# EasyEDA Pro project ProPrj_测试用途_2025-09-06.epro

# Schematic Schematic1
Board Name: Board1; Create Date: 2025-08-24; Page Name: P1; Project Name: 测试用途; Schematic Name: Schematic1; Update Date: 2025-08-30; Company: 嘉立创EDA; Page Size: A4; Version: V1.0
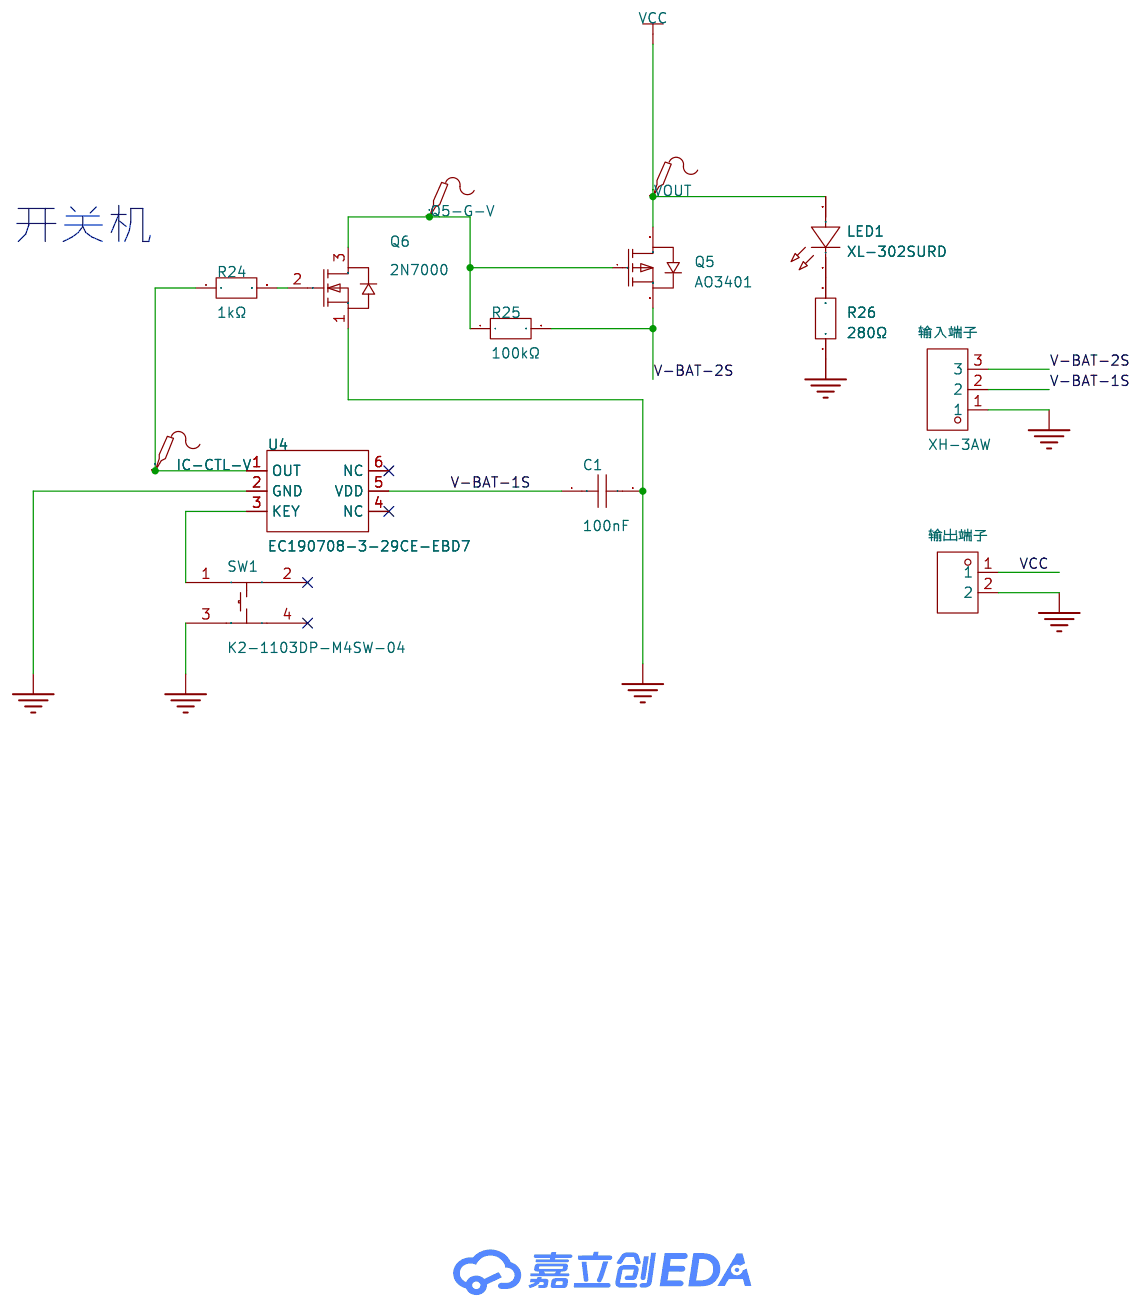
[diagram p0: schematic sheet]

## Parts
C1  100nF  [CAP-TH_L5.0-W2.5-P5.00-D1.0]
IC-CTL-V  -  [Test-Point-0.5mm]
LED1  XL-302SURD  [LED-TH_BD3.8-P2.54-RD]
Q5  AO3401  [SOT-23-3_L2.9-W1.4-P1.90-LS2.6-BR]
Q5-G-V  -  [Test-Point-0.5mm]
Q6  2N7000  [TO-92-3_L4.9-W3.7-P1.27-L]
R24  1kΩ  [RES-TH_BD2.4-L6.3-P10.30-D0.6]
R25  100kΩ  [RES-TH_BD2.4-L6.3-P10.30-D0.6]
R26  280Ω  [RES-TH_BD2.4-L6.3-P10.30-D0.6]
SW1  K2-1103DP-M4SW-04  [SW-TH_4P-L12.0-W12.0-P5.00-LS12.5_TC-1103XX]
U4  EC190708-3-29CE-EBD7  [SOT-23-6_L2.9-W1.6-P0.95-LS2.9-BL]
VOUT  -  [Test-Point-0.5mm]
输入端子  XH-3AW  [CONN-TH_3P-P2.54_HCTL_XH-3AW]
输出端子  KF301-5.0-2P  [CONN-TH_P5.00_KF301-5.0-2P]

## Library data of the parts
C1 = CC1H104MC1FD3F6C10MF: 容值:100nF;精度:±20%;额定电压:50V;温度系数:Y5V;; LCSC Part Name: 100nF ±20% 50V; Supplier Part: C254085; Manufacturer: Dersonic(德尔创); Supplier Footprint: 插件,P=5.08mm; JLCPCB Part Class: 扩展库; Datasheet: https://atta.szlcsc.com/upload/public/pdf/source/20200826/C254085_159DD65BF32BF11C9168D341BCE23E6F.pdf; Supplier: LCSC; Tolerance: ±20%; Voltage Rating: 50V; Pin Spacing: 5.08mm; Temperature Coefficient: Y5V; Diameter: 6mm; Body Thickness: 2.2mm
IC-CTL-V Q5-G-V VOUT = Test-Point: Test Point 测试点
LED1 = XL-302SURD: 灯头类型:3mm圆形灯头;发光颜色:红色;功率:80mW;正向电流:30mA;主波长:615nm~620nm;透镜颜色:红色透镜;色温:-;发光角度:50°;载带方式:-;工作温度:-25℃~+85℃;; Supplier Part: C2895470; Manufacturer: XINGLIGHT(成兴光); Supplier Footprint: 插件,D=3mm; JLCPCB Part Class: 扩展库; Datasheet: https://atta.szlcsc.com/upload/public/pdf/source/20240112/E1E2B82945FD635E4907401DDE6D4922.pdf; Supplier: LCSC; Lamp Holder Type: 3mm圆形灯头; Emitted Color: 红色; Power Dissipation: 80mW; Forward Current: 30mA; Dominant Wavelength: 615nm~620nm; Peak Wavelength: 625nm; Lens Color: 红色透镜; Viewing Angle: 50°; Operating Temperature: -25℃~+85℃
Q5 = AO3401_C727156: 类型:1个P沟道;漏源电压(Vdss):30V;连续漏极电流(Id):4.2A;导通电阻(RDS(on)@Vgs,Id):65mΩ@10V,4.2A;功率:350mW;阈值电压(Vgs(th)@Id):1.3V@250uA;; LCSC Part Name: 1个P沟道 耐压:30V 电流:4.2A; Supplier Part: C727156; Manufacturer: TWGMC(台湾迪嘉); Supplier Footprint: SOT-23; JLCPCB Part Class: 扩展库; Datasheet: https://atta.szlcsc.com/upload/public/pdf/source/20200827/C727156_6E081BBEEFBC6B8FEE164CB196B0AF30.pdf; Supplier: LCSC; Type: 1个P沟道; Drain Source Voltage (Vdss): 30V; Continuous Drain Current (Id): 4.2A; Drain Source On Resistance (RDS(on)@Vgs,Id): 65mΩ@10V,4.2A; Power Dissipation (Pd): 350mW; Gate Threshold Voltage (Vgs(th)@Id): 1.3V@250uA; Input Capacitance (Ciss@Vds): 954pF; Reverse Transfer Capacitance (Crss@Vds): 77pF; Operating Temperature: -55℃~+150℃
Q6 = 2N7000: 类型:1个N沟道;漏源电压(Vdss):60V;连续漏极电流(Id):200mA;导通电阻(RDS(on)@Vgs,Id):5Ω@10V,500mA;功率(Pd):400mW;阈值电压(Vgs(th)@Id):3V@1mA;; LCSC Part Name: 1个N沟道 耐压:60V 电流:200mA; Supplier Part: C232838; Manufacturer: onsemi(安森美); Supplier Footprint: TO-92-3; JLCPCB Part Class: 扩展库; Datasheet: https://atta.szlcsc.com/upload/public/pdf/source/20221020/6B07E43F0B4B9B39AB447A9A1885F5BD.pdf; Supplier: LCSC; Type: 1个N沟道; Drain Source Voltage (Vdss): 60V; Continuous Drain Current (Id): 200mA; Drain Source On Resistance (RDS(on)@Vgs,Id): 5Ω@10V,500mA; Power Dissipation (Pd): 400mW; Gate Threshold Voltage (Vgs(th)@Id): 3V@1mA
R24-R26 = RN1/4W10KFT/BA1: 电阻类型:金属膜电阻;阻值:10kΩ;精度:±1%;功率:250mW;温度系数:±50ppm/℃;; LCSC Part Name: 10kΩ ±1% 250mW 金属膜电阻; Supplier Part: C410695; Manufacturer: Tyohm(幸亚电阻); Supplier Footprint: 插件,D2.4xL6.5mm; JLCPCB Part Class: 扩展库; Datasheet: https://atta.szlcsc.com/upload/public/pdf/source/20250211/2C0505E212032D72CE625B2E6B5197BA.pdf; Supplier: LCSC; Type: 金属膜电阻; Tolerance: ±1%; Voltage-Supply(Max): 250V; Power(Watts): 250mW; Temperature Coefficient: ±50ppm/℃; Operating Temperature: -55℃~+125℃
SW1 = K2-1103DP-M4SW-04_C136702: Supplier Part: C136702; Supplier Footprint: 12x12mm; JLCPCB Part Class: 扩展库; Supplier: LCSC
U4 = EC190708-3-29CE-EBD7: Supplier Part: C9900183753; Supplier Footprint: SOT23-6; Supplier: LCSC
输入端子 = XH-3AW_C2908612: 插针结构:1x3P;间距:2.54mm;安装方式:弯插;参考系列:XH;总PIN数:3P;排数:1;每排PIN数:3;行距:-;额定电流:3A;触头材质:黄铜;触头镀层:锡;工作温度范围:-25℃~+85℃;; LCSC Part Name: 1x3P 间距:2.54mm 弯插 系列:XH; Supplier Part: C2908612; Manufacturer: HCTL(华灿天禄); Supplier Footprint: 弯插,P=2.5mm; JLCPCB Part Class: 扩展库; Datasheet: https://atta.szlcsc.com/upload/public/pdf/source/20230711/B565BAF3B11666EF6B81B3605408F2BD.pdf; Supplier: LCSC; Pins Structure: 1x3P; Pitch: 2.54mm; Mounting Style: 弯插; Reference Series: XH; Number of Pins: 3P; Number of Rows: 1; Number of PINs Per Row: 3; Current Rating (Max): 3A; Contact Material: 黄铜; Contact Plating: 锡; Operating Temperature Range: -25℃~+85℃
输出端子 = KF301-5.0-2P: 结构:1x2P;间距:5mm;颜色:蓝色;安装方式:直插;额定电流:17A;额定电压:250V;排数:1;线规 - AWG:14~22;线规 - 平方毫米:1.5;每排PIN数:2;工作温度范围:-30℃~+120℃;; LCSC Part Name: 5mm 1x2P 排数:1 每排P数:2 直插; Supplier Part: C474881; Manufacturer: KEFA(科发); Supplier Footprint: 插件,P=5mm; JLCPCB Part Class: 扩展库; Datasheet: https://atta.szlcsc.com/upload/public/pdf/source/20230317/03A5B5FC229D6F9225E8F51DA1A4E80A.pdf; Supplier: LCSC; Structure: 1x2P; Pitch: 5mm; Color: 蓝色; Mounting Style: 直插; Current Rating (Max): 17A; Voltage Rating (Max): 250V; Number of Pins: 2P; Number of Rows: 1; Wire Gauge - AWG: 14~22; Wire Gauge - mm2: 1.5; Number of PINs Per Row: 2; Operating Temperature Range: -30℃~+120℃

## Nets
GND: C1.2 Q6.1(S) R26.1 SW1.3 U4.2(GND) 输入端子.1 输出端子.2
VCC: LED1.2(A) Q5.3(D) VOUT.1 输出端子.1
V-BAT-1S: C1.1 U4.5(VDD) 输入端子.2
V-BAT-2S: Q5.2(S) R25.2 输入端子.3
$1N406: IC-CTL-V.1 R24.1 U4.1(OUT)
$1N407: SW1.1 U4.3(KEY)
$1N410: Q5.1(G) Q5-G-V.1 Q6.3(D) R25.1
$1N412: Q6.2(G) R24.2
$1N1137: LED1.1(K) R26.2

Not connected (* = marked no-connect by the designer): SW1 2* 4*; U4 4(NC)* 6(NC)*

## Notes on the sheet
- 开关机

# Schematic Schematic2
Board Name: Board2; Create Date: 2025-08-31; Page Name: P1; Project Name: 测试用途; Schematic Name: Schematic2; Update Date: 2025-09-03; Company: 嘉立创EDA; Page Size: A4; Version: V1.0
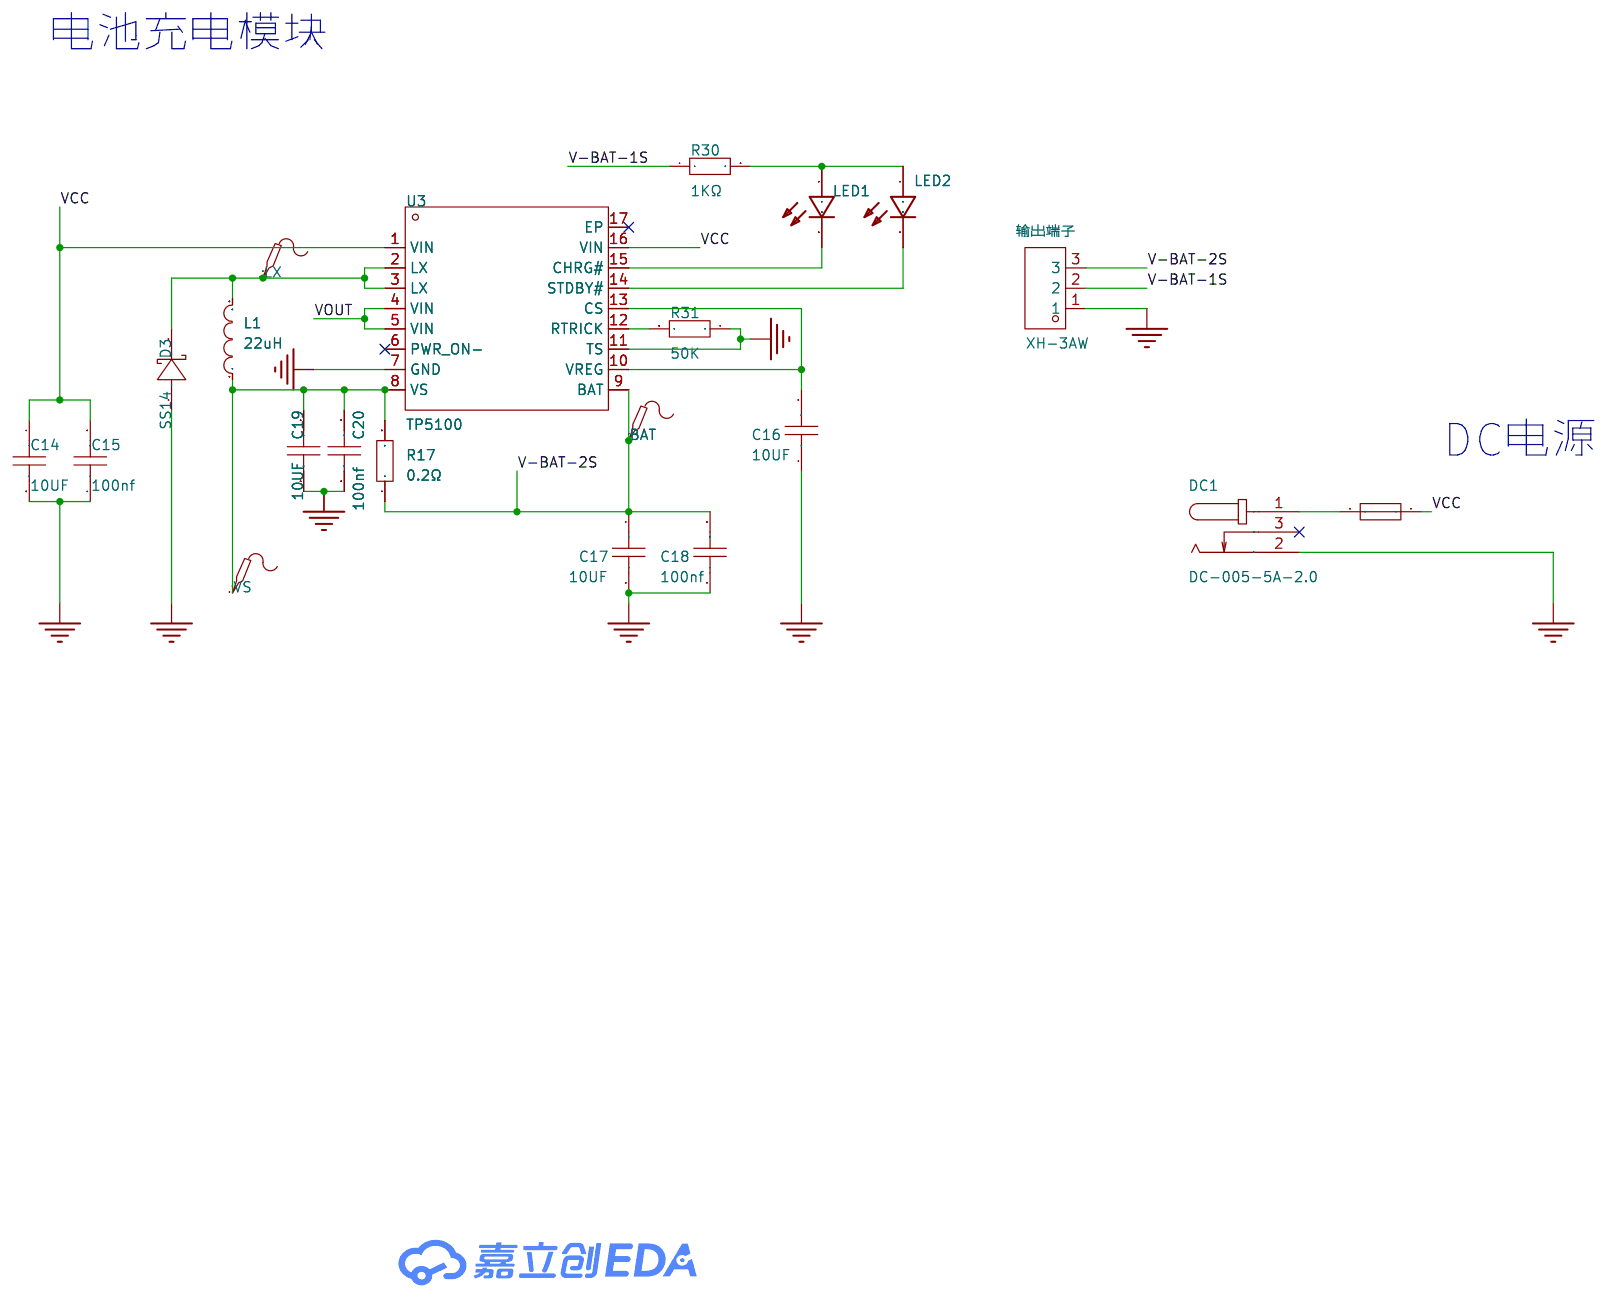
[diagram p1: schematic sheet]

## Parts
BAT  -  [Test-Point-0.5mm]
C14  10UF  [C1210]
C15  100nf  [C1206]
C16  10UF  [C1206]
C17  10UF  [C1210]
C18  100nf  [C1206]
C19  10UF  [C1210]
C20  100nf  [C1206]
D3  SS14  [SMA_L4.3-W2.6-LS5.0-FD]
DC1  DC-005-5A-2.0  [DC-IN-TH_DC-005-5A-2.0]
F1  SMD1206  [F1206]
L1  22uH  [IND-SMD_L12.0-W12.0_YPRH120X]
LED1  19-217/BHC-ZL1M2RY/3T  [LED0603-R-RD]
LED2  19-217/BHC-ZL1M2RY/3T  [LED0603-R-RD]
LX  -  [Test-Point-0.5mm]
R17  0.2Ω  [R1206]
R30  1KΩ  [R1206]
R31  50K  [R1206]
U3  TP5100  [TQFN-16_L4.0-W4.0-P0.65-BL-EP]
VS  -  [Test-Point-0.5mm]
输出端子  XH-3AW  [CONN-TH_3P-P2.54_HCTL_XH-3AW]

## Library data of the parts
BAT LX VS = Test-Point: Test Point 测试点
C14 C17 C19 = HGC1210R5476M250NSVK: 容值:47uF;精度:±20%;额定电压:25V;温度系数:X5R;; LCSC Part Name: 47uF ±20% 25V; Supplier Part: C7432791; Manufacturer: Chinocera(华瓷); Supplier Footprint: 1210; JLCPCB Part Class: 扩展库; Datasheet: https://atta.szlcsc.com/upload/public/pdf/source/20240320/FAC3FEC40A78BC5CCCE96C232A94D860.pdf; Supplier: LCSC; Tolerance: ±20%; Voltage Rating: 25V; Temperature Coefficient: X5R
C15 C16 C18 C20 = HGC1206R5106K500NSPJ: 容值:10uF;精度:±10%;额定电压:50V;温度系数:X5R;; LCSC Part Name: 10uF ±10% 50V; Supplier Part: C7432781; Manufacturer: Chinocera(华瓷); Supplier Footprint: 1206; JLCPCB Part Class: 扩展库; Datasheet: https://atta.szlcsc.com/upload/public/pdf/source/20240320/FAC3FEC40A78BC5CCCE96C232A94D860.pdf; Supplier: LCSC; Tolerance: ±10%; Voltage Rating: 50V; Temperature Coefficient: X5R
D3 = SS14_C7420316: 二极管配置:独立式;正向压降(Vf):550mV@1.0A;直流反向耐压(Vr):40V;整流电流:1A;; LCSC Part Name: 电压:40V 电流:1A; Supplier Part: C7420316; Manufacturer: 宏迦橙; Supplier Footprint: SMA(DO-214AC); JLCPCB Part Class: 扩展库; Datasheet: https://atta.szlcsc.com/upload/public/pdf/source/20230828/C73881E3299A0827586C2B1C18B17A53.pdf; Supplier: LCSC; Diode Configuration: 独立式; Forward Voltage (Vf@If): 550mV@1.0A; Reverse Voltage (Vr): 40V; Rectified Current: 1A; Reverse Leakage Current (Ir): 200uA@40V
DC1 = DC-005-5A-2.0: 连接器类型:DC电源插座;安装方式:弯插;触点内径:2mm;触点外径:6.2mm;额定电流:5A;额定电压:24V;工作温度范围:-20℃~+70℃;; LCSC Part Name: DC电源插座 内径:2mm 外径:6.2mm; Supplier Part: C381116; Manufacturer: XKB Connection(中国星坤); Supplier Footprint: 插件; JLCPCB Part Class: 扩展库; Datasheet: https://atta.szlcsc.com/upload/public/pdf/source/20211015/707A35F7AB6E89C57AAB641950105BB7.pdf; Supplier: LCSC; Connector Type: DC电源插座; Mounting Style: 弯插; Inside Contact Diameter: 2mm; Outside Contact Diameter: 6.2mm; Current Rating (Max): 5A; Voltage Rating (Max): 24V; Operating Temperature Range: -20℃~+70℃
F1 = SMD1206-150-16: 耐压(Vmax):16V;最大电流(Imax):40A;保持电流(Ihold):1.5A;跳闸电流(Itrip):3A;; Supplier Part: C46641031; Manufacturer: 宏嘉诚; Supplier Footprint: 1206; JLCPCB Part Class: 扩展库; Datasheet: https://atta.szlcsc.com/upload/public/pdf/source/20250414/5AC46D2F961B725C9DB708C91B04DBEC.pdf; Supplier: LCSC; Voltage - Max: 16V; Current - Max: 40A; Hold Current: 1.5A; Trip Current: 3A; Power Dissipation: 1W; Resistance - Initial (Ri) (Min): 25mΩ; Resistance - Post Trip (R1) (Max): 130mΩ; Time to Trip(Max): 300ms
L1 = YPRH1207-220M: 电感值:22uH;精度:±20%;额定电流:3.6A;; LCSC Part Name: 22uH ±20%; Supplier Part: C339950; Manufacturer: YJYCOIN(益嘉源); Supplier Footprint: SMD,12x12mm; JLCPCB Part Class: 扩展库; Datasheet: https://atta.szlcsc.com/upload/public/pdf/source/20200623/C339950_CB2CAFE108BC5DE837AA8F39C29DA454.pdf; Supplier: LCSC; Tolerance: ±20%; Rated Current: 3.6A; DC Resistance (DCR): 43mΩ
LED1 LED2 = 19-217/BHC-ZL1M2RY/3T: Supplier: LCSC; Manufacturer: EVERLIGHT; image: //image.lceda.cn/szlcsc/C72041.jpg; Supplier Part: C72041; JLCPCB Part Class: Basic; spicePre: L
R17 R30 R31 = 1206W4F1002T5E: 电阻类型:厚膜电阻;阻值:10kΩ;精度:±1%;功率:250mW;最大工作电压:200V;温度系数:±100ppm/℃;; LCSC Part Name: 10kΩ ±1% 250mW 厚膜电阻; Supplier Part: C17902; Manufacturer: UNI-ROYAL(厚声); Supplier Footprint: 1206; JLCPCB Part Class: 基础库; Datasheet: https://atta.szlcsc.com/upload/public/pdf/source/20200306/C422600_1E6D84923E4A46A82E41ADD87F860B5C.pdf; Supplier: LCSC; Type: 厚膜电阻; Tolerance: ±1%; Power(Watts): 250mW; Overload Voltage (Max): 200V; Temperature Coefficient: ±100ppm/℃; Operating Temperature Range: -55℃~+155℃
U3 = TP5100: Supplier Part: C379389; Manufacturer: TOPPOWER(南京拓微); Supplier Footprint: TQFN-16-EP(4x4); JLCPCB Part Class: 扩展库; Datasheet: https://atta.szlcsc.com/upload/public/pdf/source/20230625/310531CA6E48A76C009AF7A61C581768.pdf; Supplier: LCSC
输出端子 = XH-3AW_C2908612: 插针结构:1x3P;间距:2.54mm;安装方式:弯插;参考系列:XH;总PIN数:3P;排数:1;每排PIN数:3;行距:-;额定电流:3A;触头材质:黄铜;触头镀层:锡;工作温度范围:-25℃~+85℃;; LCSC Part Name: 1x3P 间距:2.54mm 弯插 系列:XH; Supplier Part: C2908612; Manufacturer: HCTL(华灿天禄); Supplier Footprint: 弯插,P=2.5mm; JLCPCB Part Class: 扩展库; Datasheet: https://atta.szlcsc.com/upload/public/pdf/source/20230711/B565BAF3B11666EF6B81B3605408F2BD.pdf; Supplier: LCSC; Pins Structure: 1x3P; Pitch: 2.54mm; Mounting Style: 弯插; Reference Series: XH; Number of Pins: 3P; Number of Rows: 1; Number of PINs Per Row: 3; Current Rating (Max): 3A; Contact Material: 黄铜; Contact Plating: 锡; Operating Temperature Range: -25℃~+85℃

## Nets
GND: C14.2 C15.1 C16.1 C17.2 C18.1 C19.2 C20.1 D3.1(A) DC1.2 R31.1 U3.7(GND) U3.11(TS) 输出端子.1
VCC: C14.1 C15.2 F1.1 U3.1(VIN) U3.16(VIN)
V-BAT-1S: R30.1 输出端子.2
V-BAT-2S: BAT.1 C17.1 C18.2 R17.1 U3.9(BAT) 输出端子.3
VOUT: U3.4(VIN) U3.5(VIN)
$1N694: D3.2(K) L1.2 LX.1 U3.2(LX) U3.3(LX)
$1N699: C16.2 U3.10(VREG) U3.13(CS)
$1N702: C19.1 C20.2 L1.1 R17.2 U3.8(VS) VS.1
$1N712: R31.2 U3.12(RTRICK)
Net-(DC1-1): DC1.1 F1.2
Net-(LED1-1): LED1.1(A) LED2.1(A) R30.2
Net-(LED1-2): LED1.2(C) U3.15(CHRG#)
Net-(LED2-2): LED2.2(C) U3.14(STDBY#)

Not connected (* = marked no-connect by the designer): DC1 3*; U3 6(PWR_ON-)* 17(EP)*

## Notes on the sheet
- 电池充电模块
- DC电源

# Board PCB1
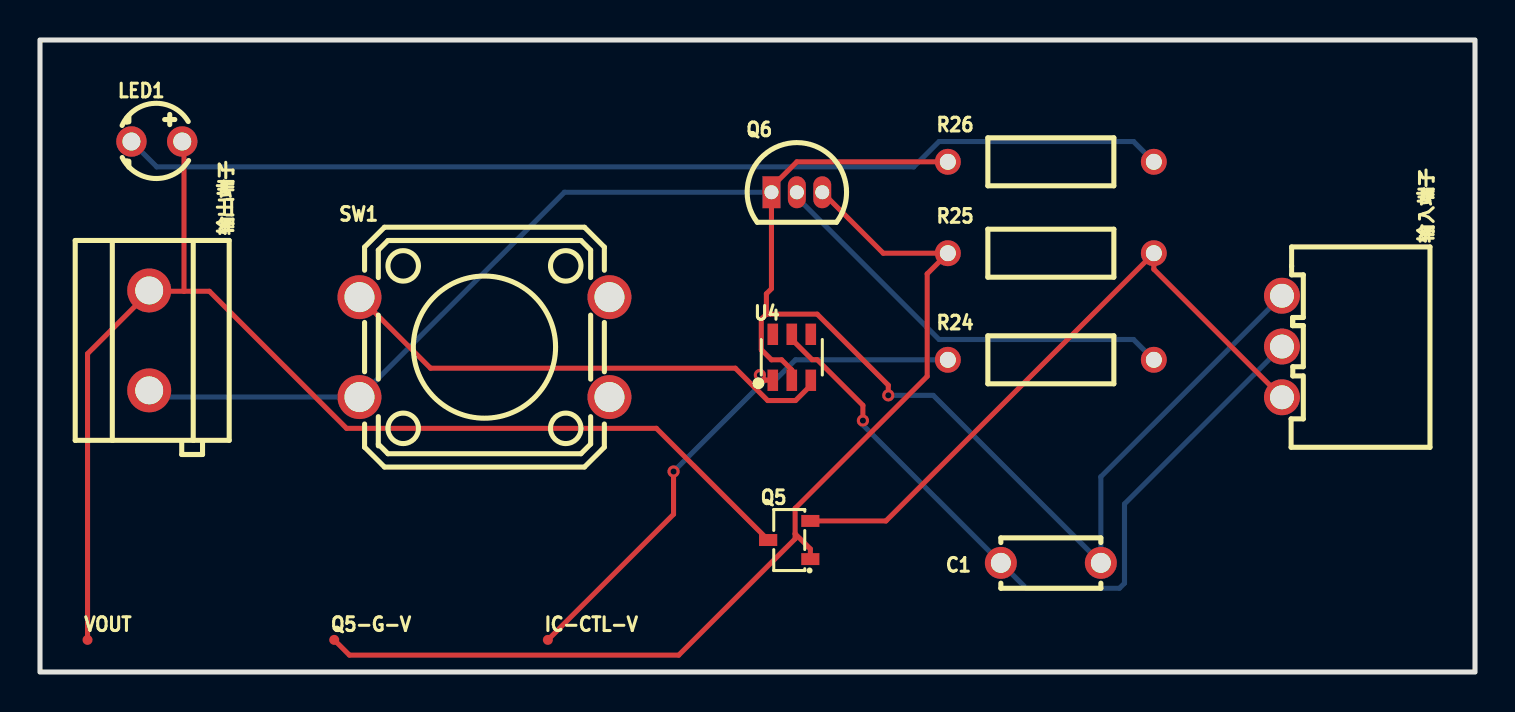
[diagram p2: board, top side]
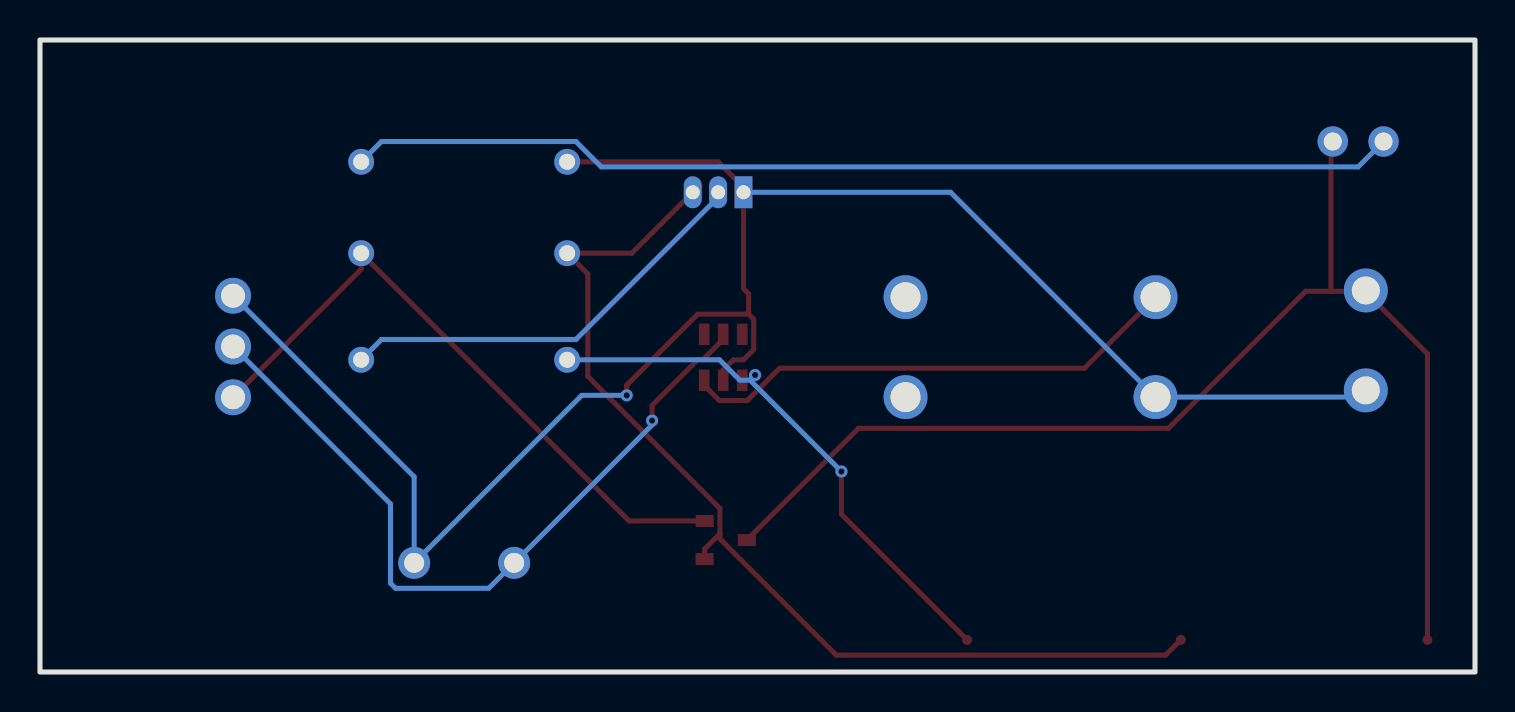
[diagram p3: board, bottom side, seen from below]

Outline 71.75 x 31.62 mm; copper layers: Top Layer, Bottom Layer. Coordinates in mm from the lower left corner of the outline.
Outline path: rectangle 0,31.62 71.75,0
Stack: Top Layer 0.035mm / Dielectric1 1.51mm FR4 er 4.5 / Bottom Layer 0.035mm

## Design rules (mm)
template: JLCPCB Capability(Two Layers Board)
spacing copperThickness1oz (default): track to track 0.102, other pairs 0.152 to 0.3
spacing copperThickness2oz: track to track 0.203, other pairs 0.152 to 0.3
track width copperThickness1oz (default): min 0.127, default 0.254, max 2.54
track width copperThickness2oz: min 0.203, default 0.254, max 2.54
differential pair differentialPair (default): width min 0.127, default 0.254, max 2.54; gap min 0.152, default 0.152
via viaSize (default): diameter min 0.5, default 0.61, max 10; hole min 0.3, default 0.305, max 6.3

## Placement (name value [footprint] x y rotation side)
C1  100nF  [CAP-TH_L5.0-W2.5-P5.00-D1.0]  50.55 5.46 0 top
IC-CTL-V  -  [Test-Point-0.5mm]  25.4 1.61 0 top
LED1  XL-302SURD  [LED-TH_BD3.8-P2.54-RD]  5.84 26.54 0 top
Q5  AO3401  [SOT-23-3_L2.9-W1.4-P1.90-LS2.6-BR]  37.46 6.6 0 top
Q5-G-V  -  [Test-Point-0.5mm]  14.71 1.61 0 top
Q6  2N7000  [TO-92-3_L4.9-W3.7-P1.27-L]  37.85 24 0 top
R24  1kΩ  [RES-TH_BD2.4-L6.3-P10.30-D0.6]  50.55 15.62 0 top
R25  100kΩ  [RES-TH_BD2.4-L6.3-P10.30-D0.6]  50.55 20.95 0 top
R26  280Ω  [RES-TH_BD2.4-L6.3-P10.30-D0.6]  50.55 25.53 0 top
SW1  K2-1103DP-M4SW-04  [SW-TH_4P-L12.0-W12.0-P5.00-LS12.5_TC-1103XX]  22.23 16.26 0 top
U4  EC190708-3-29CE-EBD7  [SOT-23-6_L2.9-W1.6-P0.95-LS2.9-BL]  37.59 15.75 0 top
VOUT  -  [Test-Point-0.5mm]  2.38 1.61 0 top
输入端子  XH-3AW  [CONN-TH_3P-P2.54_HCTL_XH-3AW]  62.1 16.29 270 top
输出端子  KF301-5.0-2P  [CONN-TH_P5.00_KF301-5.0-2P]  5.46 16.59 270 top

## Footprints (pads in the part's own frame, mm; a bottom-side part is the same pattern mirrored in y, then rotated)
CAP-TH_L5.0-W2.5-P5.00-D1.0
  round 1.6 hole 1: 1(-2.5,0) 2(2.5,0)
CONN-TH_3P-P2.54_HCTL_XH-3AW
  round 1.8 hole 1.199: 1(-2.54,0) 2(0.002,0) 3(2.54,0)
CONN-TH_P5.00_KF301-5.0-2P
  round 2.2 hole 1.4: 1(-2.5,0) 2(2.5,0)
LED-TH_BD3.8-P2.54-RD
  round 1.524 hole 0.9: 1(-1.27,0) 2(1.27,0)
RES-TH_BD2.4-L6.3-P10.30-D0.6
  round 1.3 hole 0.8: 1(-5.15,0) 2(5.15,0)
SOT-23-3_L2.9-W1.4-P1.90-LS2.6-BR
  rect 0.91x0.6 smd: 1(1.055,-0.955) 2(1.055,0.955) 3(-1.055,0)
SOT-23-6_L2.9-W1.6-P0.95-LS2.9-BL
  rect 0.532x1.072 smd: 1(-0.95,-1.149) 2(0,-1.149) 3(0.95,-1.149) 4(0.95,1.149) 5(0,1.149) 6(-0.95,1.149)
SW-TH_4P-L12.0-W12.0-P5.00-LS12.5_TC-1103XX
  round 2.2 hole 1.5: 1(-6.25,2.5) 2(6.25,2.5) 3(-6.25,-2.5) 4(6.25,-2.5)
Test-Point-0.5mm
  round 0.5 smd: 1(0,0)
TO-92-3_L4.9-W3.7-P1.27-L
  rect 0.9x1.6 hole 0.7: 1(-1.27,0)
  oval 0.9x1.6 hole 0.7: 2(0,0) 3(1.27,0)

## Nets
As in the schematic.

Pads without a net: SW1 2 4; U4 4 6

## Via types
v1: diameter 0.61, hole 0.305, Top Layer to Bottom Layer, 4 vias

## Routing (per net, layer and track width the routed paths; a pad name or vN(x,y) marks a point on that pad's centre or on a via; arc(x,y) is an arc through that point)
GND: length 94.9
  Top Layer w0.254: U4.2 37.59,15.11 37.08,15.62 36.58,15.62 36.07,16.13 36.07,17.65 36.32,17.91 ; 36.32,17.91 38.86,17.91 42.42,14.35 v1(42.42,13.84) ; 36.32,17.91 36.32,18.92 36.58,19.18 Q6.1 36.58,24.26 37.85,25.53 R26.1
  Bottom Layer w0.254: 输入端子.1 53.05,9.77 C1.2 44.66,13.84 v1(42.42,13.84) ; 输出端子.2 5.8,13.76 SW1.3 26.22,24 Q6.1
VCC: length 62.4
  Top Layer w0.254: LED1.2 7.2,26.45 7.2,19.05 ; Q5.3 30.82,12.19 15.33,12.19 8.47,19.05 7.2,19.05 ; 5.5,19.05 输出端子.1 ; 5.5,19.05 7.2,19.05 ; 5.5,19.05 2.38,15.92 VOUT.1
V-BAT-1S: length 37.8
  Top Layer w0.254: U4.5 37.59,16.64 38.61,15.63 38.86,15.63 41.15,13.34 v1(41.15,12.58)
  Bottom Layer w0.254: v1(41.15,12.58) 41.15,12.36 C1.1 49.32,4.19 53.98,4.19 54.23,4.45 54.23,8.41 输入端子.2
V-BAT-2S: length 32.6
  Top Layer w0.254: Q5.2 42.3,7.56 55.7,20.95 55.7,20.15 输入端子.3
$1N406: length 28.2
  Top Layer w0.254: v1(36,14.86) 36.25,14.61 36.64,14.61 ; IC-CTL-V.1 31.68,7.89 v1(31.68,10.03)
  Bottom Layer w0.254: R24.1 37.78,15.62 36.76,14.61 36.25,14.61 ; 36.25,14.61 v1(31.68,10.03) ; 36.25,14.61 v1(36,14.86)
$1N407: length 25.3
  Top Layer w0.254: SW1.1 19.53,15.2 34.77,15.2 36.39,13.58 37.78,13.58 38.54,14.34 U4.3
$1N410: length 52.4
  Top Layer w0.254: Q5.1 38.52,6.16 37.76,6.92 ; 37.76,6.92 37.76,8.19 44.36,14.79 44.36,19.92 R25.1 42.16,20.95 Q6.3 ; 37.76,6.92 37.76,6.67 31.94,0.85 15.47,0.85 Q5-G-V.1
$1N412: length 21.5
  Bottom Layer w0.254: Q6.2 37.85,23.75 44.96,16.64 54.68,16.64 55.7,15.62
$1N1137: length 52.6
  Bottom Layer w0.254: 4.57,26.54 5.84,25.27 43.69,25.27 44.96,26.54 54.68,26.54 55.7,25.53

# Board PCB3
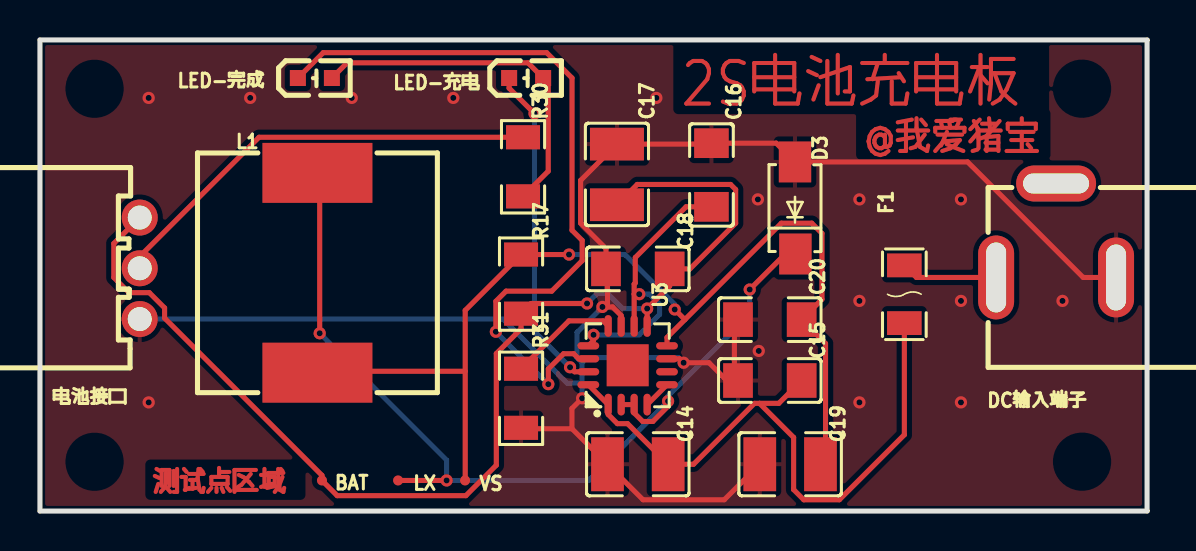
[diagram p4: board, top side]
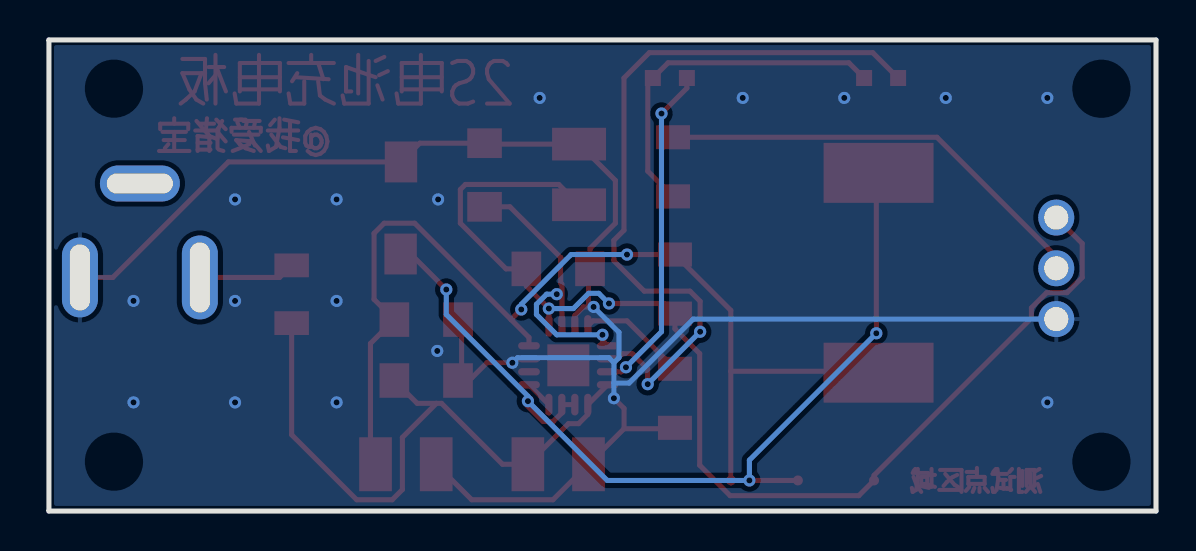
[diagram p5: board, bottom side, seen from below]

Outline 55.39 x 23.58 mm; copper layers: Top Layer, Bottom Layer. Coordinates in mm from the lower left corner of the outline.
Outline path: 0,23.58 55.39,23.58 55.39,0 0,0 0,23.58
Stack: Top Layer 0.035mm / Dielectric1 1.51mm FR4 er 4.5 / Bottom Layer 0.035mm

## Design rules (mm)
template: JLCPCB Capability(Two Layers Board)
spacing copperThickness1oz (default): track to track 0.102, other pairs 0.152 to 0.3
spacing copperThickness2oz: track to track 0.203, other pairs 0.152 to 0.3
track width copperThickness1oz (default): min 0.127, default 0.254, max 2.54
track width copperThickness2oz: min 0.203, default 0.254, max 2.54
differential pair differentialPair (default): width min 0.127, default 0.254, max 2.54; gap min 0.152, default 0.152
via viaSize (default): diameter min 0.5, default 0.61, max 10; hole min 0.3, default 0.305, max 6.3

## Placement (name value [footprint] x y rotation side)
BAT  -  [Test-Point-0.5mm]  14.11 1.53 180 top
C14  10UF  [C1210]  29.91 2.34 180 top
C15  100nf  [C1206]  36.51 6.53 0 top
C16  10UF  [C1206]  33.59 16.82 270 top
C17  10UF  [C1210]  28.87 16.85 90 top
C18  100nf  [C1206]  29.91 12.12 0 top
C19  10UF  [C1210]  37.53 2.34 180 top
C20  100nf  [C1206]  36.51 9.58 0 top
D3  SS14  [SMA_L4.3-W2.6-LS5.0-FD]  37.78 15.17 270 top
DC输入端子  DC-005-5A-2.0  [DC-IN-TH_DC-005-5A-2.0]  50.84 14.04 180 top
F1  SMD1206  [F1206]  43.25 10.85 90 top
L1  22uH  [IND-SMD_L12.0-W12.0_YPRH120X]  13.88 11.93 90 top
LED-充电  19-217/BHC-ZL1M2RY/3T  [LED0603-R-RD]  24.32 21.67 0 top
LED-完成  19-217/BHC-ZL1M2RY/3T  [LED0603-R-RD]  13.75 21.67 0 top
LX  -  [Test-Point-0.5mm]  17.92 1.53 90 top
R17  0.2Ω  [R1206]  24.07 11.36 90 top
R30  1KΩ  [R1206]  24.17 17.23 270 top
R31  50K  [R1206]  24.07 5.64 90 top
U3  TP5100  [TQFN-16_L4.0-W4.0-P0.65-BL-EP]  29.4 7.3 0 top
VS  -  [Test-Point-0.5mm]  21.27 1.53 270 top
电池接口  XH-3AW  [CONN-TH_3P-P2.54_HCTL_XH-3AW]  4.99 12.15 90 top

## Footprints (pads in the part's own frame, mm; a bottom-side part is the same pattern mirrored in y, then rotated)
C1206
  rect 1.485x1.728 smd: 1(-1.593,0) 2(1.593,0)
C1210
  rect 1.635x2.7 smd: 1(-1.518,0) 2(1.518,0)
CONN-TH_3P-P2.54_HCTL_XH-3AW
  round 1.8 hole 1.199: 1(-2.54,0) 2(0.002,0) 3(2.54,0)
DC-IN-TH_DC-005-5A-2.0
  oval 1.8x4.2 hole 1x3.5: 1(3,2.352)
  oval 1.8x4 hole 1x3.3: 2(-3,2.352)
  oval 4x1.8 hole 3.3x1: 3(-0.001,-2.352)
F1206
  rect 1.19x1.728 smd: 1(-1.445,0) 2(1.445,0)
IND-SMD_L12.0-W12.0_YPRH120X
  rect 3x5.5 smd: 1(-5,0) 2(5,0)
LED0603-R-RD
  rect 0.8x0.8 smd: 1(0.851,0) 2(-0.851,0)
R1206
  rect 1.208x1.701 smd: 1(-1.479,0) 2(1.479,0)
SMA_L4.3-W2.6-LS5.0-FD
  rect 2.046x1.62 smd: 1(-2.304,-0.009) 2(2.304,0.009)
Test-Point-0.5mm
  round 0.5 smd: 1(0,0)
TQFN-16_L4.0-W4.0-P0.65-BL-EP
  oval 0.364x1.087 smd: 1(-0.975,-1.968) 2(-0.325,-1.968) 3(0.325,-1.968) 4(0.975,-1.968) 9(0.975,1.968) 10(0.325,1.968) 11(-0.325,1.968) 12(-0.975,1.968)
  oval 1.087x0.364 smd: 5(1.968,-0.975) 6(1.968,-0.325) 7(1.968,0.325) 8(1.968,0.975) 13(-1.968,0.975) 14(-1.968,0.325) 15(-1.968,-0.325) 16(-1.968,-0.975)
  rect 2.1x2.1 smd: 17(0,0)

## Nets
GND: C14.2 C15.1 C16.1 C17.2 C18.1 C19.2 C20.1 D3.1 DC输入端子.2 R31.1 U3.7 U3.11 电池接口.1
VCC: C14.1 C15.2 F1.1 U3.1 U3.16
V-BAT-1S: R30.1 电池接口.2
V-BAT-2S: BAT.1 C17.1 C18.2 R17.1 U3.9 电池接口.3
VOUT: U3.4 U3.5
$1N690: LED-充电.2 U3.15
$1N694: D3.2 L1.2 LX.1 U3.2 U3.3
$1N699: C16.2 U3.10 U3.13
$1N702: C19.1 C20.2 L1.1 R17.2 U3.8 VS.1
$1N706: LED-完成.2 U3.14
$1N708: LED-充电.1 LED-完成.1 R30.2
$1N712: R31.2 U3.12
$1N1690: DC输入端子.1 F1.2

Pads without a net: DC输入端子 3; U3 6 17

## Via types
v1: diameter 0.61, hole 0.305, Top Layer to Bottom Layer, 33 vias

## Routing (per net, layer and track width the routed paths; a pad name or vN(x,y) marks a point on that pad's centre or on a via; arc(x,y) is an arc through that point)
GND: length 95.7
  Top Layer w0.254: 28.39,10.22 28.39,12.05 C18.1 28.32,13.14 27.05,14.41 27.05,16.55 C17.2 33.55,18.37 C16.1 36.84,18.41 D3.1 46.41,17.47 52.19,11.69 DC输入端子.2 ; 28.39,10.22 v1(28.14,10.22) ; 28.39,10.22 28.65,10.22 29.08,9.79 U3.11 ; 34.74,6.66 C15.1 ; 34.74,6.66 34.74,9.4 C20.1 ; 34.74,6.66 34.24,6.66 33.47,7.42 v1(32.2,7.42) 32,7.62 U3.7 ; 26.62,4.12 C14.2 30.17,0.56 34.24,0.56 C19.2 ; 26.62,4.12 24.11,4.12 R31.1 ; 26.62,4.12 26.62,5.14 v1(27.12,5.64)
  Bottom Layer w0.254: 27.12,6.41 27.12,7.42 ; 27.12,6.41 26.36,6.41 23.16,9.61 电池接口.1 ; 27.12,6.41 v1(27.12,5.64) ; 27.12,7.42 26.87,7.68 26.87,8.95 v1(28.14,10.22) ; 27.12,7.42 27.38,7.68 31.95,7.68 v1(32.2,7.42)
  vias: v1(5.44,20.68) v1(5.44,5.44) v1(10.52,20.68) v1(15.6,20.68) v1(20.68,20.68) v1(30.84,20.68) v1(35.92,15.6) v1(35.96,8.01) v1(41,15.6) v1(41,10.52) v1(41,5.44) v1(46.08,15.6) v1(46.08,10.52) v1(46.08,5.44) v1(51.16,10.52) v1(51.16,5.44)
VCC: length 32.1
  Top Layer w0.254: U3.16 U3.1 28.43,4.83 28.89,4.37 29.4,4.37 C14.1 32.7,2.34 35.75,5.39 36,5.39 ; C15.2 36.96,5.39 36,5.39 ; 36,5.39 37.71,3.69 37.71,1.07 38.21,0.56 39.99,0.56 43.25,3.82 F1.1
V-BAT-1S: length 22.2
  Top Layer w0.254: 电池接口.2 4.99,12.74 10.96,18.71 R30.1
V-BAT-2S: length 59.1
  Top Layer w0.254: 电池接口.3 3.69,13.39 3.69,11.69 4.46,10.93 5.47,10.93 6.23,10.17 6.23,9.66 14.11,1.79 BAT.1 14.87,0.77 21.31,0.77 22.83,2.29 22.83,7.88 24.07,9.12 R17.1 24.58,10.39 v1(27.37,10.39) ; U3.9 v1(30.38,10.13) 31.5,11.26 C18.2 32.52,12.12 34.81,14.41 34.81,16.09 34.55,16.35 29.88,16.35 C17.1
  Bottom Layer w0.254: v1(27.37,10.39) 27.88,10.9 28.39,10.9 29.15,10.13 v1(30.38,10.13)
VOUT: length 1.4
  Top Layer w0.254: U3.4 U3.5
$1N690: length 16.7
  Top Layer w0.254: v1(24.74,19.9) 23.47,21.17 LED-充电.2 ; U3.15 26.75,6.97 v1(26.52,7.2)
  Bottom Layer w0.254: v1(26.52,7.2) 24.74,8.97 v1(24.74,19.9)
$1N694: length 47
  Top Layer w0.254: v1(13.99,8.9) 13.99,16.81 L1.2 ; D3.2 37.29,12.87 v1(35.51,11.09) ; v1(20.34,1.53) LX.1 ; U3.2 U3.3 29.73,4.91 30.15,4.48 30.66,4.48 31.42,5.25 v1(31.42,5.5)
  Bottom Layer w0.254: v1(13.99,8.9) 20.34,2.55 v1(20.34,1.53) 27.46,1.53 v1(31.42,5.5) 31.42,5.75 35.51,9.84 v1(35.51,11.09)
$1N699: length 14.7
  Top Layer w0.254: C16.2 32.32,15.23 29.78,12.69 29.78,11.42 29.73,11.36 29.73,10.85 ; U3.13 27.7,8.53 v1(27.7,8.82) ; 29.73,10.85 U3.10 ; 29.73,10.85 v1(29.98,10.85)
  Bottom Layer w0.254: v1(29.98,10.85) 30.49,10.85 31,10.35 31,9.84 29.98,8.82 v1(27.7,8.82)
$1N702: length 52.9
  Top Layer w0.254: 32.27,9.58 31.37,8.69 U3.8 ; 32.27,9.58 v1(31.76,10.09) ; 32.27,9.58 37.09,14.41 38.62,14.41 39.12,13.9 39.12,10.6 C20.2 39.3,8.39 39.3,2.6 C19.1 ; L1.1 13.95,7 21.27,7 ; 21.27,7 21.27,10.04 R17.2 v1(26.47,12.84) ; 21.27,7 21.27,1.54
  Bottom Layer w0.254: v1(26.47,12.84) 29.26,12.84 31.76,10.34 v1(31.76,10.09)
$1N706: length 37.7
  Top Layer w0.254: v1(22.81,8.97) 22.81,10.5 23.32,11.01 25.6,11.01 27.13,12.53 27.13,13.55 26.62,14.05 26.62,21.67 25.35,22.94 14.17,22.94 LED-完成.2 ; U3.14 26.96,7.62 26.7,7.87 26.19,7.87 25.43,7.11 v1(25.43,6.35)
  Bottom Layer w0.254: v1(22.81,8.97) v1(25.43,6.35)
$1N708: length 17.8
  Top Layer w0.254: R30.2 25.43,17.01 25.43,21.42 24.41,22.44 15.37,22.44 LED-完成.1
$1N712: length 5.5
  Top Layer w0.254: U3.12 28.17,9.52 26.46,9.52 R31.2
$1N1690: length 4.8
  Top Layer w0.254: F1.2 43.85,11.69 DC输入端子.1

## Copper pours and planes (outline as drawn; the poured copper is in the pictures)
GND on Top Layer: 61.28,27.52 61.28,-5.15 -4.03,-5.15 -4.03,27.52
GND on Bottom Layer: 59.88,24.72 59.88,-3.37 -3.26,-3.37 -3.26,24.72

## Text on the board
Top Layer: @我爱猪宝 | 2S电池充电板 | 测试点区域
